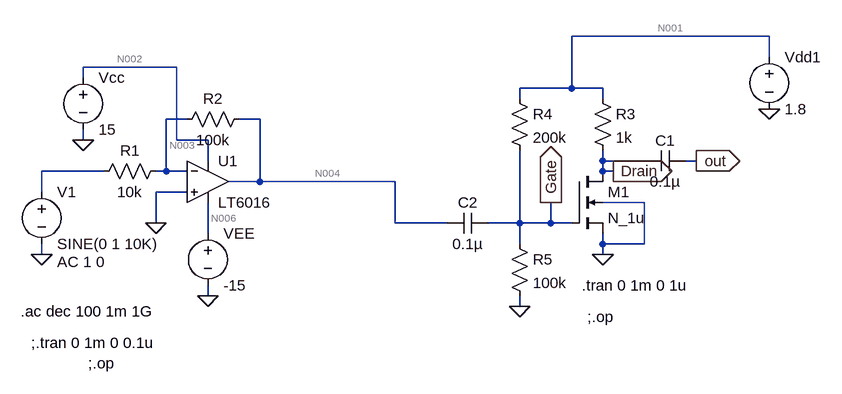
[diagram p0: schematic opamp_2stage.asc]
* opamp_2stage.asc
* U1: LT6016 (symbol OpAmps\LT6016 not available, pins judged from their places): In+=0 In-=N003 V+=N002 V-=N006 OUT=N004
R1 N003 N005 10k
R2 N004 N003 100k
V1 N005 0 SINE(0 1 10K) AC 1 0
Vcc N002 0 15
VEE N006 0 -15
M1 Drain Gate 0 0 N_1u l=1u w=448u
R3 N001 Drain 1k
C1 out Drain 0.1µ
C2 Gate N004 0.1µ
R4 N001 Gate 200k
R5 Gate 0 100k
Vdd1 N001 0 1.8
.model NMOS NMOS
.model PMOS PMOS
.lib standard.mos
.ac dec 100 1m 1G
;.op
;.tran 0 1m 0 0.1u
.tran 0 1m 0 1u
;.op
.backanno
.end

* Results of the author's LTspice run, read from the files saved beside the schematic
* Operating Point, zero values left out:
*   V(n006) = -15 V
*   V(n002) = 15 V
*   V(n004) = 176.5 µV
*   V(n003) = -20.2 nV
*   V(drain) = 1.796 V
*   V(gate) = 600 mV
*   V(n001) = 1.8 V
*   V(out) = 179.6 nV
*   Id(M1) = 3.6 µA
*   Ib(M1) = -1.806 pA
*   Is(M1) = -3.6 µA
*   I(R5) = 6 µA
*   I(R4) = 6 µA
*   I(R3) = 3.6 µA
*   I(R2) = 1.765 nA
*   I(R1) = -2.02 pA
*   I(Vdd1) = -9.6 µA
*   I(Vee) = 345.9 µA
*   I(Vcc) = -345.9 µA
*   I(V1) = -2.02 pA
*   Ix(u1:1) = 1.767 nA
*   Ix(u1:2) = 1.767 nA
*   Ix(u1:3) = 345.9 µA
*   Ix(u1:4) = -345.9 µA
*   Ix(u1:5) = -1.751 nA
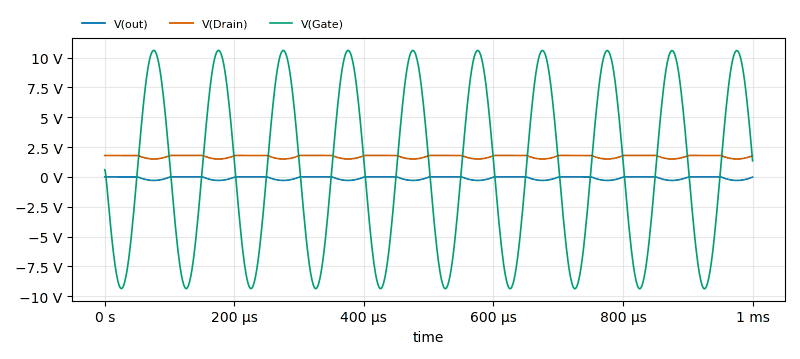
[diagram p1: Transient Analysis of opamp_2stage.asc, plotted from the saved traces]
* Transient Analysis, 1 run:
*   V(out): min -292.8 mV, max 3.6 mV, average -94.57 mV, rms 150.1 mV, last -14.57 mV
*   V(Drain): min 1.504 V, max 1.8 V, average 1.702 V, rms 1.706 V, last 1.782 V
*   V(Gate): min -9.377 V, max 10.61 V, average 731 mV, rms 7.091 V, last 1.348 V